# Altium schematic sheet uMultimeter_USB_Sch.SchDoc: MicroMultimeter - USB
size 127 x 101 mm; Author: Hom; CompanyName: KitSprout; DrawnBy: Hom; Engineer: Hom; Organization: KitSprout; Revision: B; SheetNumber: 1; SheetTotal: 1; License: CC BY-SA 4.0; Version: 2.0; LibVersion: 2.1; PageSetup: Record=PageOptions|CenterHorizontal=True|CenterVertical=True|PrintScale=1.00|XCorrection=1.00|YCorrection=1.00|PrintKind=0|BorderSize=5000000|LeftOffset=0|BottomOffset=0|Orientation=2|PaperLength=1000|PaperWidth=1000|Scale=100|PaperSource=7|PrintQuality=-3|MediaType=1|DitherType=10|PrintScaleMode=0|PaperKind=A4|PaperIndex=9
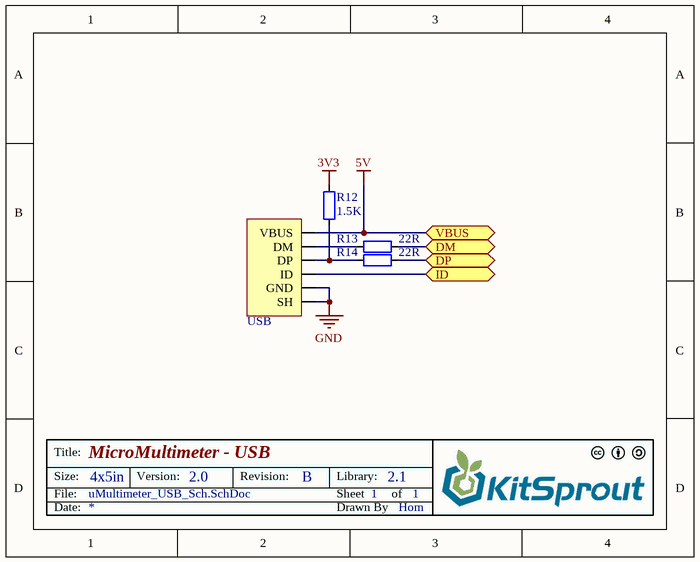
[diagram p0: uMultimeter_USB_Sch.SchDoc]

## Parts
R12  value 1.5K  [RES_0603]  (hidden comment: Res_0603)
R13  value 22R  [RES_0603]  (hidden comment: Res_0603)
R14  value 22R  [RES_0603]  (hidden comment: Res_0603)
USB  USB_Micro  [USB_Micro-AB]  (value not drawn)

## Ports
DM, DP, ID, VBUS

## Nets
3V3: R12.1
5V: USB.1(VBUS) ; port VBUS
GND: USB.0(SH) USB.5(GND)
DM: R13.2 ; port DM
DP: R14.2 ; port DP
ID: USB.4(ID) ; port ID
NetR12_2: R12.2 R14.1 USB.3(DP)
NetR13_1: R13.1 USB.2(DM)

## Notes on the sheet
- Title:
- Size:
- Date:
- File:
- 4x5in
- Version:
- Revision:
- Sheet
- Drawn By
- Library:
- of

## Library data of the parts
R12-R14 = Res_0603: Resistor
USB = USB_Micro: USB